# Altium schematic sheet TemperatureSensor.SchDoc: Extra Temperature Connection
size A4; DrawnBy: Jonn Dillon; DocumentNumber: 8; Revision: 01; SheetNumber: 8; SheetTotal: 10; Version: 01; Project: Battery Managment System 2020; PageSetup: Record=PageOptions|CenterHorizontal=True|CenterVertical=True|PrintScale=0.97|XCorrection=1.00|YCorrection=1.00|PrintKind=0|BorderSize=5000000|LeftOffset=0|BottomOffset=0|Orientation=2|PaperLength=1000|PaperWidth=1000|Scale=100|PaperSource=7|PrintQuality=-4|MediaType=1|DitherType=10|PaperKind=A4|PrintScaleMode=1
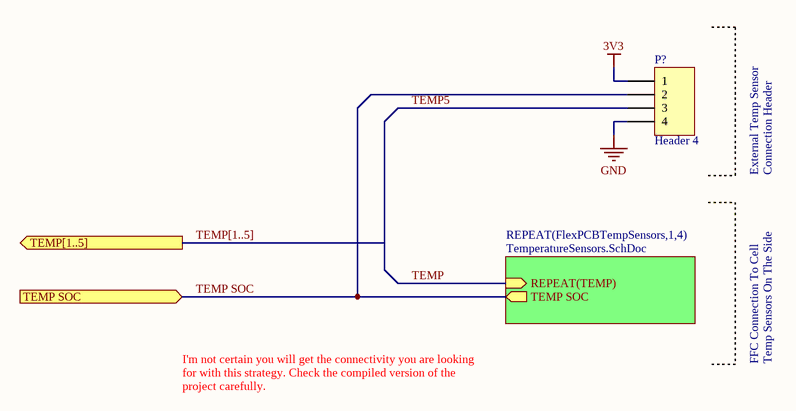
[diagram p0: TemperatureSensor.SchDoc]

## Parts
P?  Header 4  [HDR1X4]

## Sub-sheets
REPEAT(FlexPCBTempSensors,1,4) = TemperatureSensors.SchDoc: REPEAT(TEMP) (in), TEMP SOC (out)

## Ports
TEMP SOC (in), TEMP[1..5] (out)

## Nets
3V3: P?.1
GND: P?.4
TEMP: sheet REPEAT(FlexPCBTempSensors,1,4)/REPEAT(TEMP)
TEMP5: P?.3
TEMP SOC: P?.2 ; port TEMP SOC, sheet REPEAT(FlexPCBTempSensors,1,4)/TEMP SOC

## Buses and harness runs
bus TEMP[1..5] = port TEMP[1..5]

## Notes on the sheet
- External Temp Sensor
- Connection Header
- I'm not certain you will get the connectivity you are looking for with this strategy. Check the compiled version of the project carefully.
- FFC Connection To Cell
- Temp Sensors On The Side
- Revision History:
- Sheet Title:
- Rev
- Date
- Description
- Project:
- Size:
- Drawn By:
- A3
- Number:
- Revision:
- Sheet
- Version:
- of
- QUT Motorsport
- O-120, Gardens Point
- 2 George Street
- Brisbane, QLD 4000
- Australia
- Print Date:
- Print Time:
- File Name:

## Library data of the parts
P? = Header 4: Header, 4-Pin; LatestRevisionDate: 17-Jul-2002; LatestRevisionNote: Re-released for DXP Platform.; Publisher: Altium Limited